# Altium schematic sheet STWD100 Wathdog Timer.SchDoc: STWD100 Watchdog Timer
size Letter; SheetNumber: 12; SheetTotal: 18
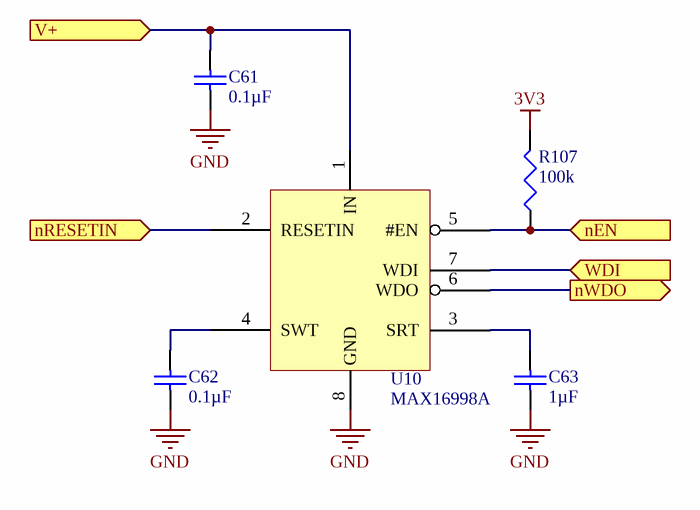
[diagram p0: STWD100 Wathdog Timer.SchDoc]

## Parts
C61  value 0.1µF  [TDK-CGA2B]  (hidden comment: Cap)
C62  value 0.1µF  [TDK-CGA2B]  (hidden comment: Cap)
C63  value 1µF  [TY-0402V]  (hidden comment: Cap)
R107  value 100k  [PANA-ERJ2R]  (hidden comment: Res3)
U10  MAX16998A  [MAX-21-0036]

## Ports
nEN (in), nRESETIN (in), nWDO (out), V+ (in), WDI (in)

## Nets
3V3: R107.2
GND: C61.2 C62.2 C63.1 U10.8(GND)
nEN: R107.1 U10.5(#EN) ; port nEN
nRESETIN: U10.2(RESETIN) ; port nRESETIN
nWDO: U10.6(WDO) ; port nWDO
V+: C61.1 U10.1(IN) ; port V+
WDI: U10.7(WDI) ; port WDI
NetC62_1: C62.1 U10.4(SWT)
NetC63_2: C63.2 U10.3(SRT)

## Notes on the sheet
- (the "License"); you may not use or redistribute this file except in compliance with the License. You
- This file and the information within it are licensed under the terms of the Apache License, Version 2.0
- Copyright
- Unless required by applicable law or agreed to in writing, content distributed under the License is
- distributed on an "AS IS" BASIS, WITHOUT WARRANTIES OR CONDITIONS OF ANY KIND,
- either express or implied. See the License for the specific language governing permissions and
- limitations under the License.
- may obtain a copy of the License at:
- http://www.apache.org/licenses/LICENSE-2.0
- Title
- Size:
- Date:
- Letter
- Number:
- Time:
- Revision:
- Sheet
- of
- University of Alberta
- Deptartment of Electrical
- and Computer Engineering
- Edmonton AB, Canada
- T6G 1H9
- File:

## Library data of the parts
C61 C62 = PC-TDK-02259: CAP CER 0.1UF 50V X7R 0402; Manufacturer Part Number: CGA2B3X7R1H104K050BB; Index: 2259; Designator: C?; Tolerance: ±10%; Published: 2016-03-16; LatestRevisionDate: 2016-03-16; LatestRevisionNote: ...; PackageReference: 0402 (1005 Metric); Publisher: AlbertaSat; PackageDescription: Radial Cap, Thru-Hole; 2 Leads; 0.3 in Pin Spacing; Part Number: PC-TDK-02259; Supplier Part Number 1: 445-6899-1-ND; Supplier 1: Digi-key; Supplier Link: http://www.digikey.ca/product-search/en?keywords=445-6899-1-ND; Voltage - Rated: 50V; Temperature Coefficient: X7R; Applications: Automotive
C63 = PC-TY-00381: CAP CER 1UF 25V X5R 0402; Manufacturer Part Number: TMK105BJ105MV-F; Index: 381; Designator: C?; Tolerance: ±20%; Published: 2016-03-13; LatestRevisionDate: 2016-03-13; LatestRevisionNote: ...; PackageReference: 0402 (1005 Metric); Publisher: AlbertaSat; PackageDescription: Chip Capacitor, 2-Leads, Body 1.00x0.50mm, IPC Low Density; Part Number: PC-TY-00381; Supplier Part Number 1: 587-3245-1-ND; Supplier 1: Digi-key; Supplier Link: http://www.digikey.ca/product-search/en?keywords=587-3245-1-ND; Voltage-Rated: 25V; Temperature Coefficient: X5R; Application: General Purpose
R107 = 18739: RES SMD 100K OHM 1% 1/10W 0402; Part Number: 18739; Manufacturer Part Number: ERJ-2RKF1003X; Designator: R?; Power: 0.1W, 1/10W; Temperature Coefficient: ±100ppm/°C; Published: 8-Jun-2000; LatestRevisionDate: 29-May-2009; LatestRevisionNote: IPC-7351 Footprint Added.; PackageReference: 0402 (1005 Metric); Publisher: Altium Limited; PackageDescription: Chip Resistor, 2-Leads, Body 1.00x0.50mm, IPC Low Density; Supplier Part Number 1: P100KLCT-ND; Supplier 1: Digi-Key; Supplier Link: http://www.digikey.ca/product-search/en?keywords=P100KLCT-ND; Tolerance: ±1%
U10 = PU-MAX-00002: IC TIMER WATCHDOG 8UMAX; Manufacturer Part Number: MAX16998AAUA/V+; Index: 2; Designator: U?; Part Number: PU-MAX-00002; Supplier Part Number 1: MAX16998AAUA/V+-ND; Supplier 1: Digi-key; Supplier Part Number 2: 700-MAX16998AAUA/V+; Supplier 2: Mouser; Publisher: AlbertaSat; Published: 2017-04-06; LatestRevisionDate: 2017-04-06; LatestRevisionNote: ...; PackageReference: 8-uMAX; PackageDescription: TSOP, 8-Leads, Body 3.00x3.00mm, Pitch 0.65mm, IPC Low Density; Supplier Link: https://www.digikey.ca/product-search/en?keywords=MAX16998AAUA/V+-ND; Applications: Automotive